# EasyEDA schematic 1-Schematic_WCP Board.json
TITLE: Sheet_1; REV: 1.0; Date: 2023-10-06; Sheet: 1/1; Drawn By: katepogge17; Company: Your Company
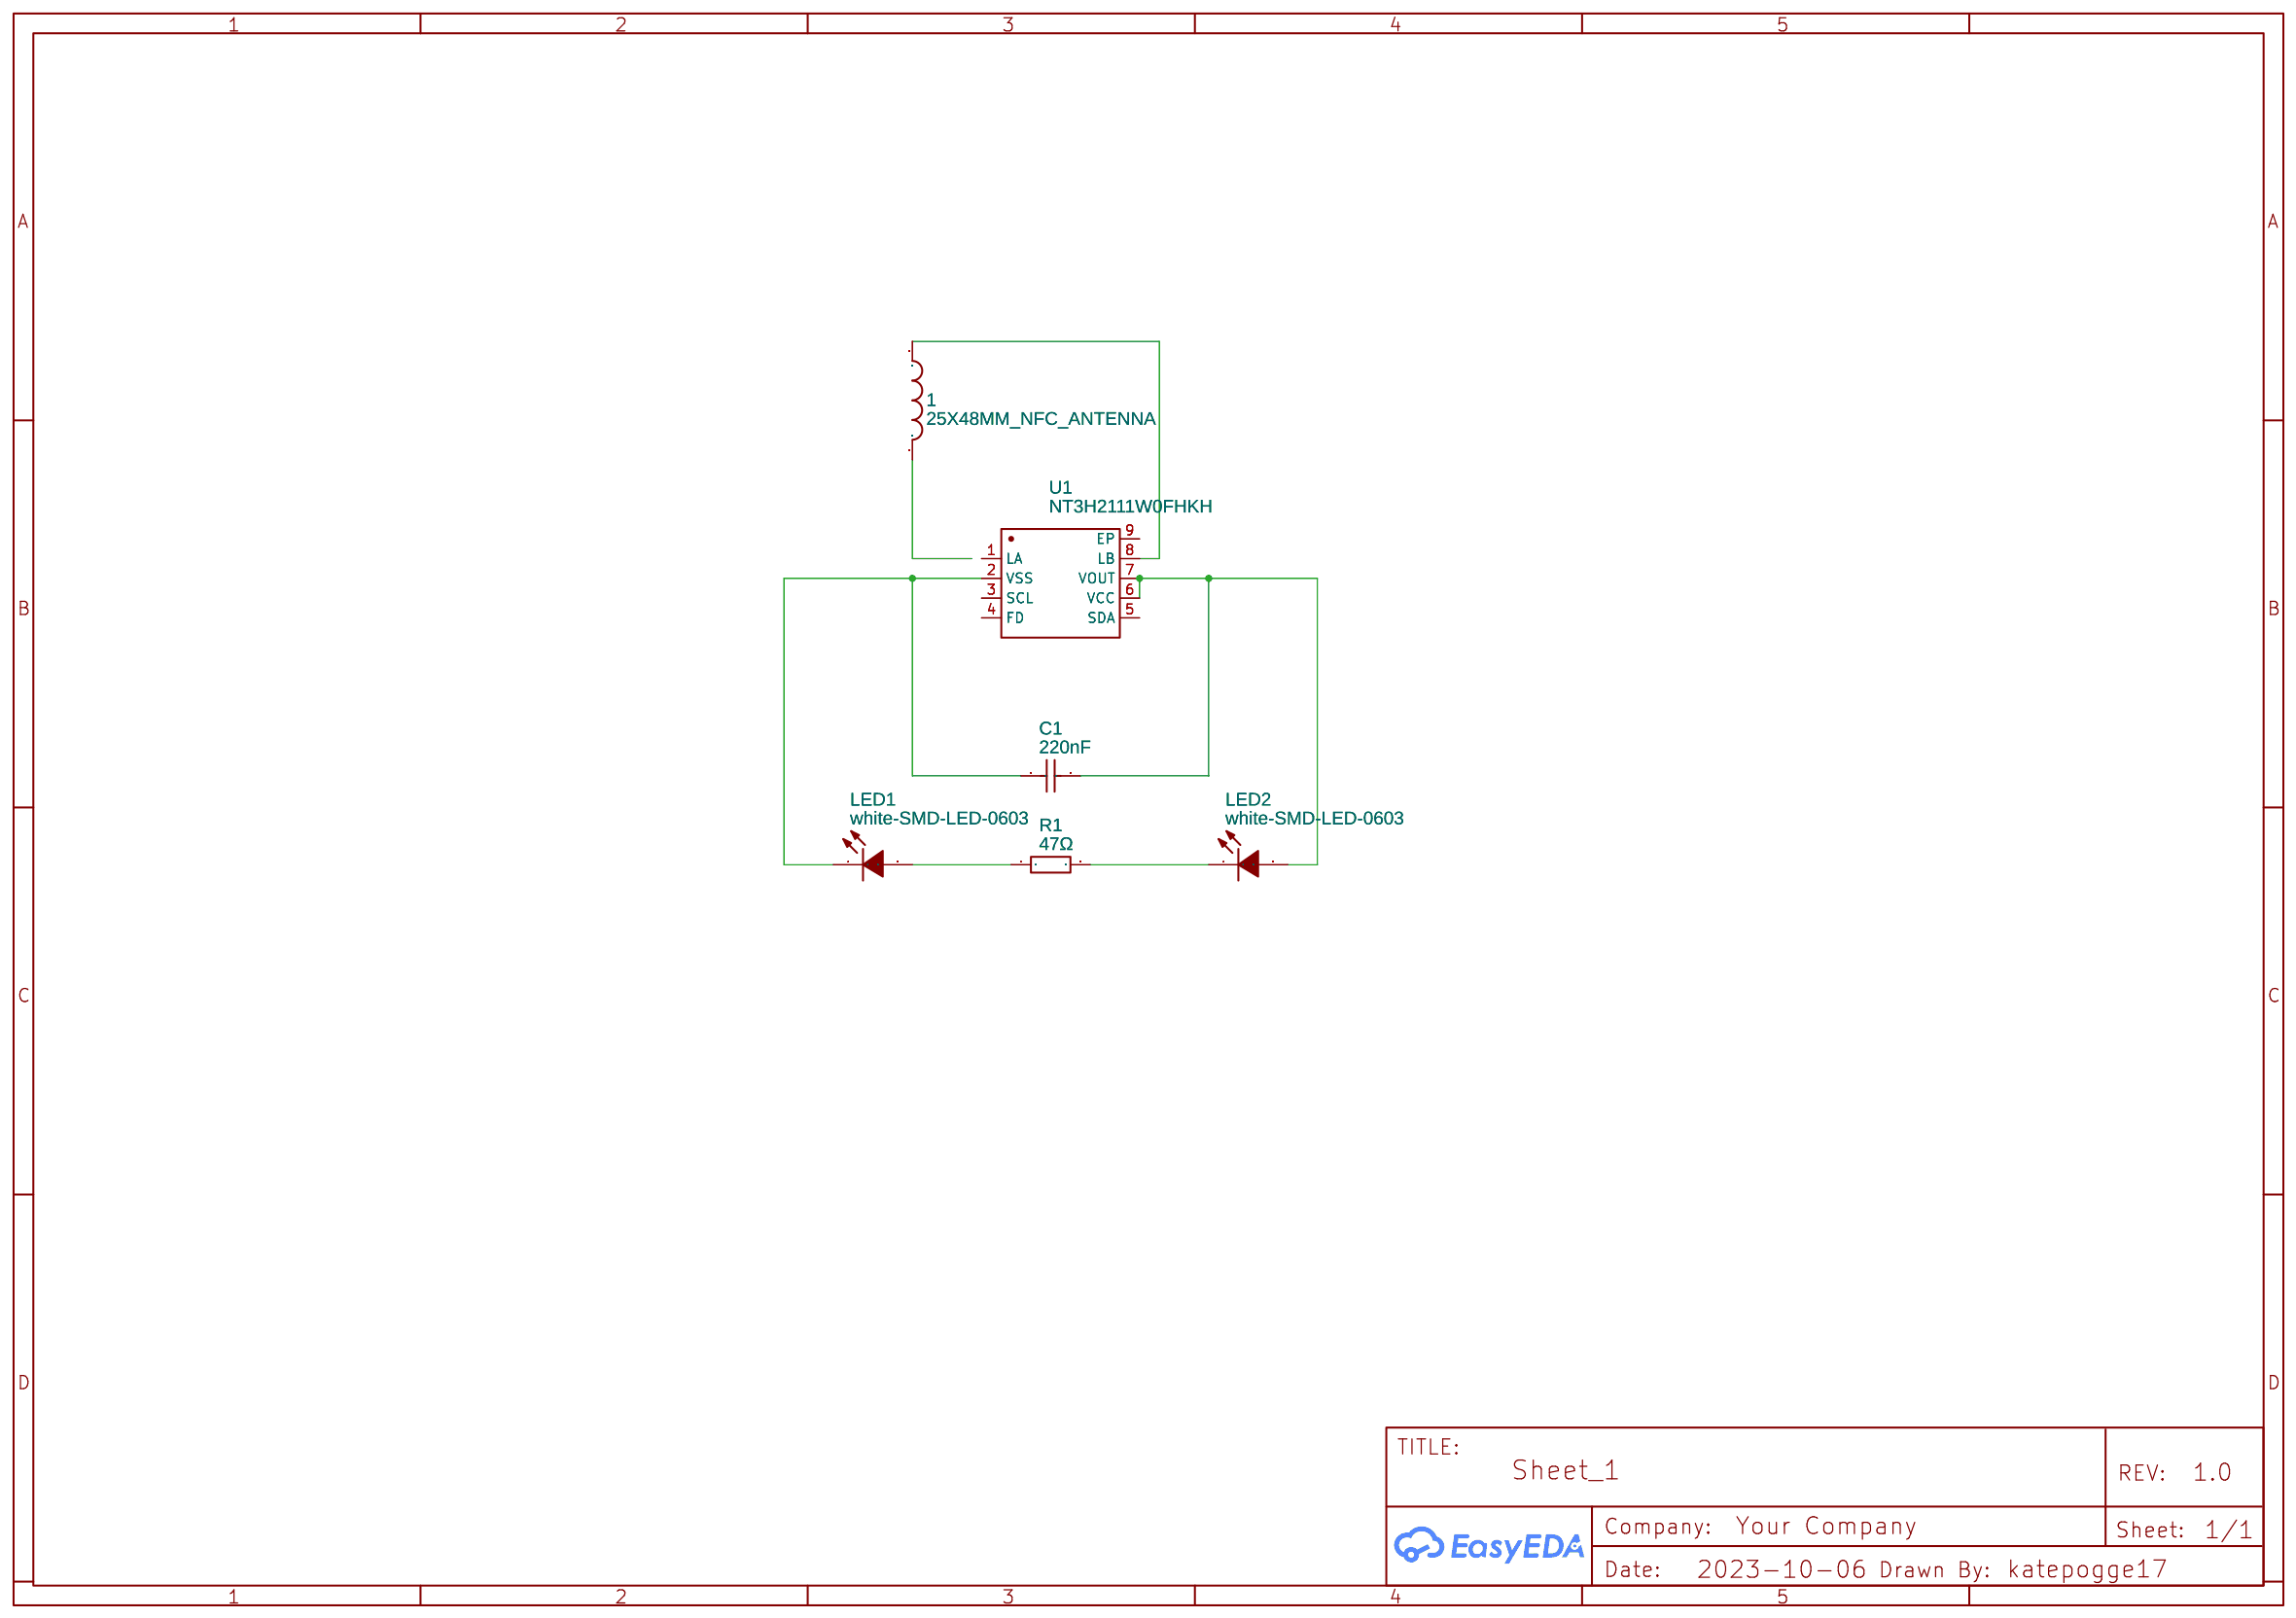
[diagram p0: schematic sheet]

## Parts
1  25X48MM_NFC_ANTENNA  [25X48MM_NFC_ANTENNA]
C1  220nF  [C0603]
LED1  white-SMD-LED-0603  [LED0603-RD_WHITE]
LED2  white-SMD-LED-0603  [LED0603-RD_WHITE]
R1  47Ω  [R0603]
U1  NT3H2111W0FHKH  [XQFN-8_L1.6-W1.6-P0.50-BL]

## Library data of the parts
1 = 25X48MM_NFC_ANTENNA: Contributor: Спас Христов
C1 = CL10B224KA8NNNC: Supplier: LCSC; Manufacturer: SAMSUNG(三星); Supplier Part: C21120; JLCPCB Part Class: Basic Part; link: https://lcsc.com/eda_search?q=C21120&%26type=1&ref=editor
LED1 LED2 = white-SMD-LED-0603: Contributor: LCSC; Supplier: LCSC; Supplier Part: C9900005808; Manufacturer: null; Manufacturer Part: 白光贴片LED-0603; JLCPCB Part Class: Extended Part; link: https://lcsc.com/eda_search?q=C9900005808&%26type=1&ref=editor
R1 = 0603WAF470JT5E: Supplier: LCSC; Manufacturer: UNI-ROYAL(厚声); Supplier Part: C23182; JLCPCB Part Class: Basic Part; link: https://lcsc.com/eda_search?q=C23182&%26type=1&ref=editor
U1 = NT3H2111W0FHKH: Contributor: LCSC; Supplier: LCSC; Supplier Part: C710403; Manufacturer: NXP(恩智浦); JLCPCB Part Class: Extended Part; link: https://lcsc.com/eda_search?q=C710403&%26type=1&ref=editor

## Nets
Net-(1-P$1): 1.P$1 U1.8(LB)
Net-(C1-1): C1.1 LED1.1(K) U1.2(VSS)
Net-(C1-2): C1.2 LED2.2(A) U1.6(VCC) U1.7(VOUT)
Net-(LED1-2): LED1.2(A) R1.1
Net-(LED2-1): LED2.1(K) R1.2

Not connected (* = marked no-connect by the designer): 1 P$2; U1 1(LA) 3(SCL) 4(FD) 5(SDA) 9(EP)
